# EasyEDA Pro project miniMQ.epro, schematic Controller
Board Name: Controller; Create Date: 2026-08-29; Page Name: P1; Project Name: MagicQ Compact Mini Connect; Schematic Name: Controller; Update Date: 2026-09-06; Company: EasyEDA.com; Page Size: A4; Version: V1.0
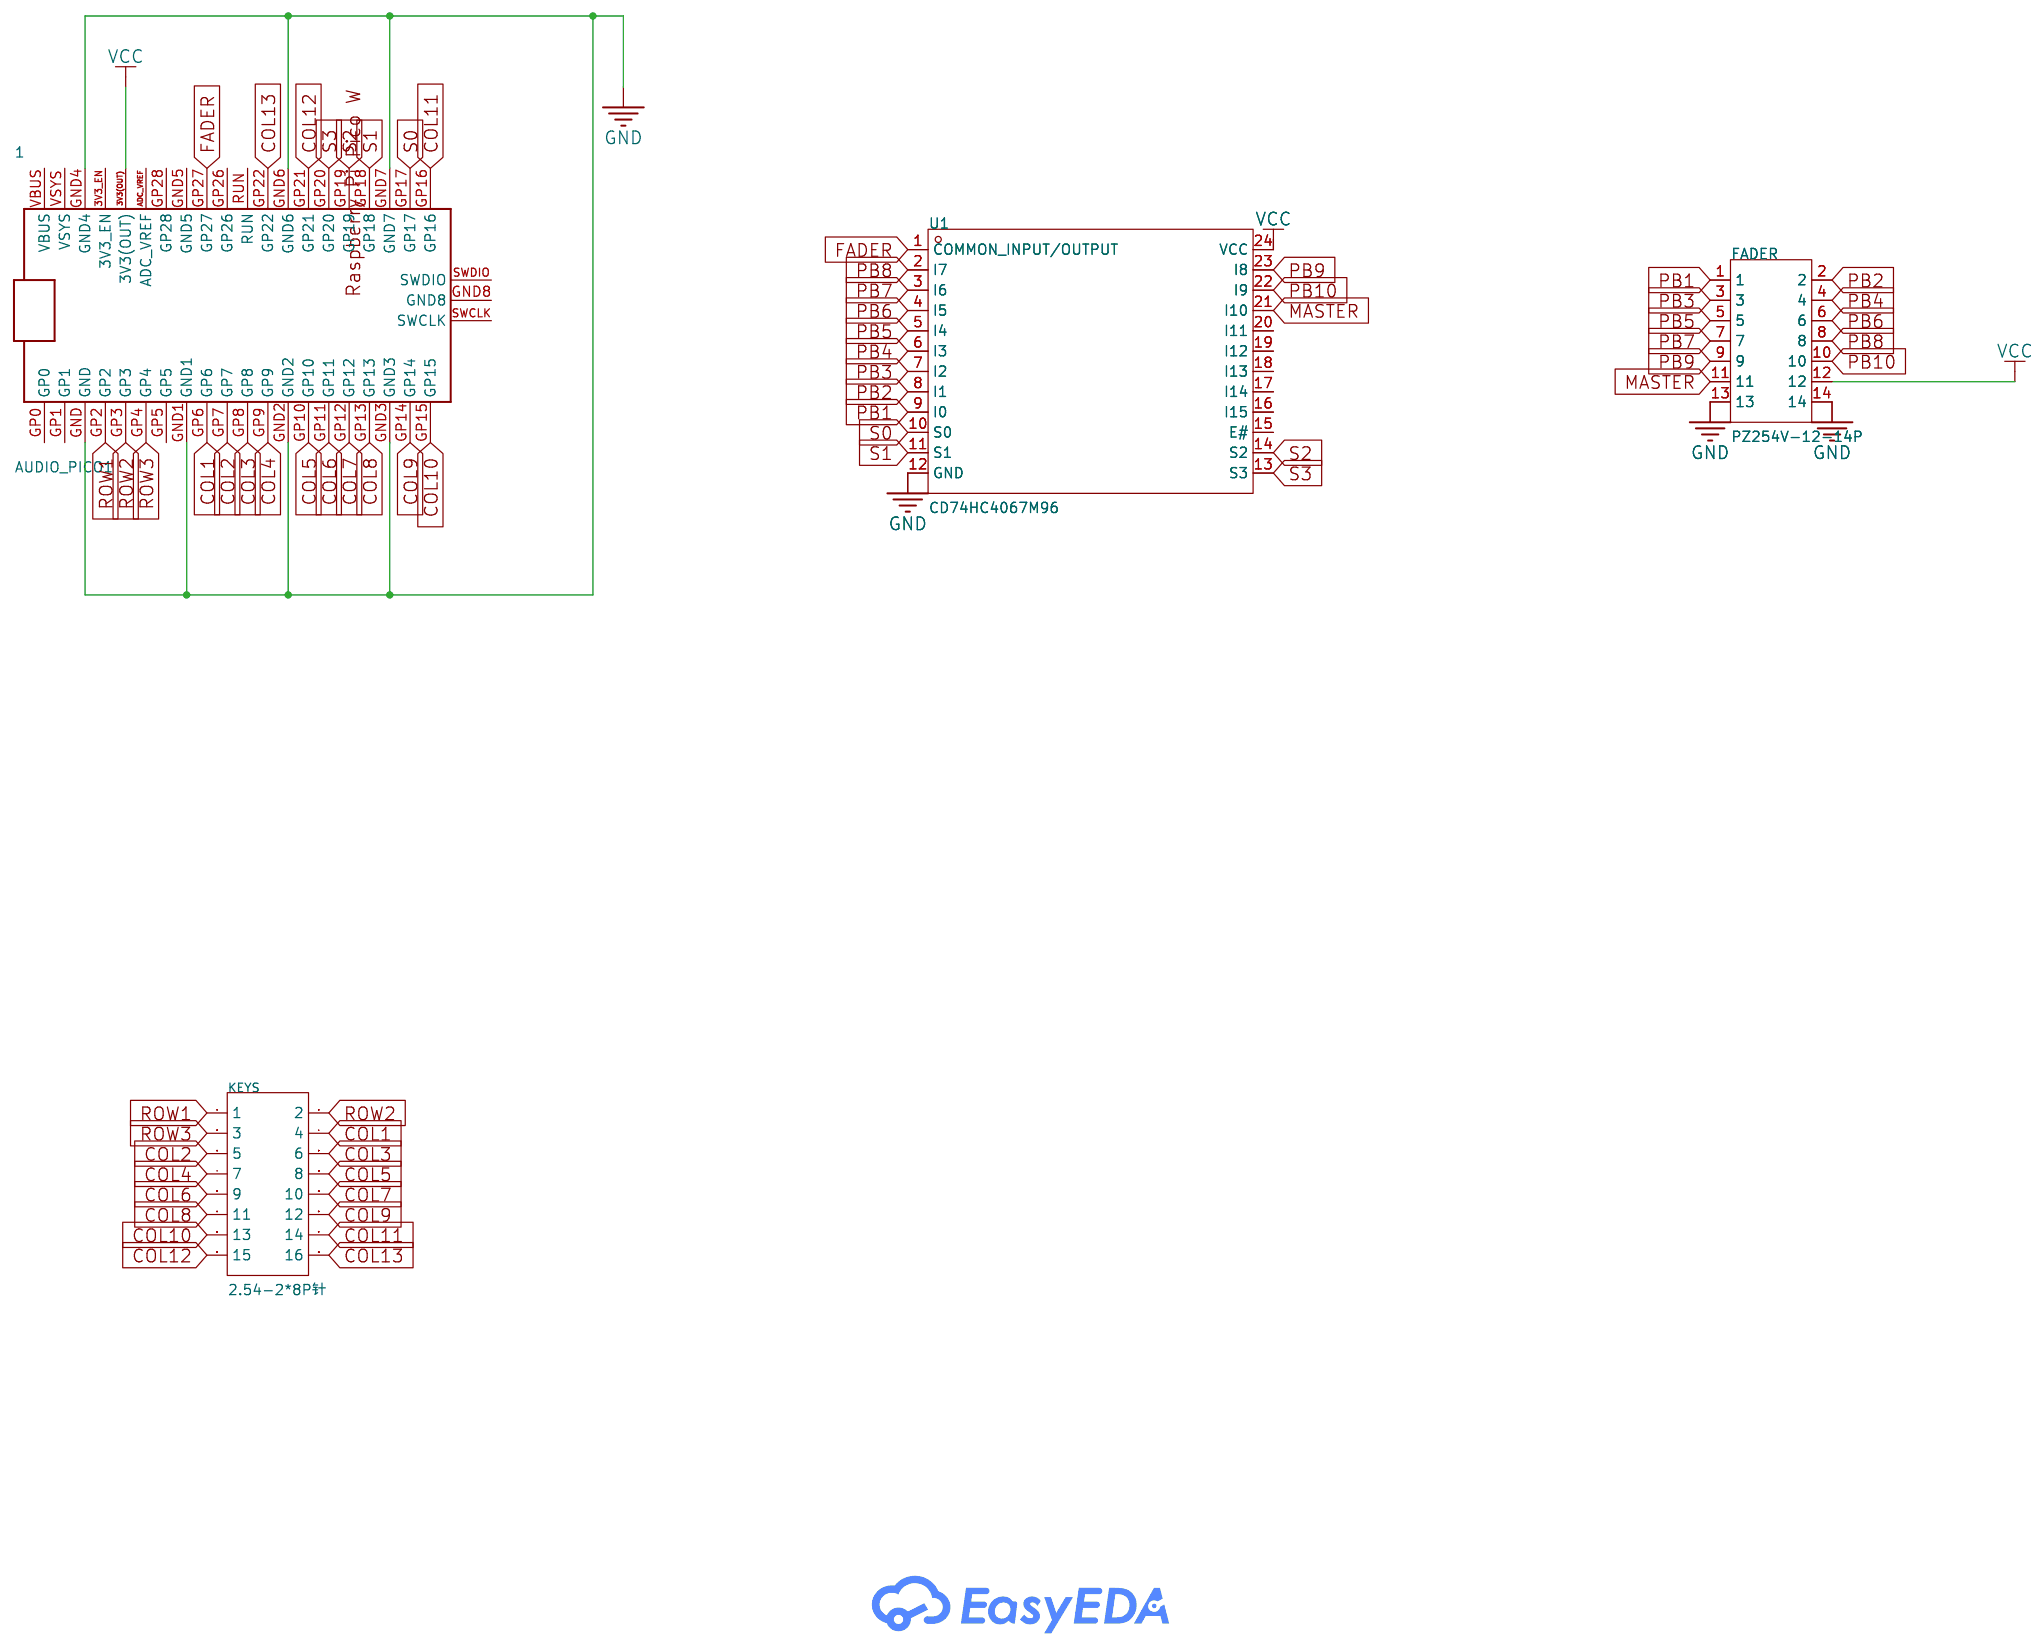
[diagram p0: schematic sheet]

## Parts
1  AUDIO_PICO1  [RASPBERRYPIPICO]
FADER  PZ254V-12-14P  [HDR-TH_14P-P2.54-V-M-R2-C7-S2.54]
KEYS  2.54-2*8P针  [HDR-TH_16P-P2.54-V-M-R2-C8-S2.54]
U1  CD74HC4067M96  [SOIC-24_L15.4-W7.5-P1.27-LS10.3-BL]

## Library data of the parts
1 = AUDIO_PICO1: Manufacturer Part: RASPBERRY PI PICO; Supplier: Element14; Supplier Part: 3643332; Manufacturer: Raspberry-PI; link: https://se.farnell.com/b/raspberry-pi
FADER = PZ254V-12-14P: Pin Structure:2x7P Pitch:2.54mm Row Spacing:2.54mm Circluar Pins/Square Pins:Pin Header Mounting Type:Through Hole Number of Rows:2 Number of Pins:14P Current Rating:- Voltage Rating (Max):- Length of Mating Pin:6mm Insulation Height:2.5mm Length of End C; LCSC Part Name: 2x7P 间距:2.54mm 方针 直插; Supplier Part: C492424; Manufacturer: XFCN(兴飞); Supplier Footprint: 插件,P=2.54mm; JLCPCB Part Class: Extended Part; Datasheet: https://item.szlcsc.com/datasheet/PZ254V-12-14P/502980.html; Supplier: LCSC; Pin Structure: 2x7P; Pitch: 2.54mm; Row Spacing: 2.54mm; Circluar Pins/Square Pins: Pin Header; Mounting Type: Through Hole; Number of Rows: 2; Number of Pins: 14P; Length of Mating Pin: 6mm; Insulation Height: 2.5mm; Length of End Connection Pin: 3mm; Contact Material: Brass; Operating Temperature: -40℃~+105℃; Color: Black
KEYS = 2.54-2*8P针_C68234: Pin Structure:2x8P Pitch:2.54mm Row Spacing:2.54mm Circluar Pins/Square Pins:Pin Header Mounting Type:Through Hole Number of Rows:2 Number of Pins:16P Current Rating:3A Voltage Rating (Max):- Length of Mating Pin:5.9mm Insulation Height:2.54mm Length of E; LCSC Part Name: 2x8P 间距:2.54mm 方针 直插; Supplier Part: C68234; Manufacturer: BOOMELE(博穆精密); Supplier Footprint: 插件,P=2.54mm; JLCPCB Part Class: Extended Part; Datasheet: https://item.szlcsc.com/datasheet/2.54-2*8P%25E9%2592%2588/69336.html; Supplier: LCSC; Pin Structure: 2x8P; Pitch: 2.54mm; Row Spacing: 2.54mm; Circluar Pins/Square Pins: Pin Header; Mounting Type: Through Hole; Number of Rows: 2; Number of Pins: 16P; Current Rating: 3A; Length of Mating Pin: 5.9mm; Insulation Height: 2.54mm; Length of End Connection Pin: 3mm; Contact Material: Brass; Contact Plating: Gold; Operating Temperature: -55℃~+105℃; Color: Black
U1 = CD74HC4067M96: Switch Circuit:16:1 Number of Channels:16 Ron:70Ω Voltage - Supply:2V~6V Voltage - Supply:2V~6V Con:- Turn-on time:83ns Turn-off time:83ns Bandwidth:89MHz Operating Temperature:-55℃~+125℃ Operating Temperature:-55℃~+125℃ Propagation Delay (tpd):15ns Featu; LCSC Part Name: 高速CMOS逻辑16通道模拟多路复用器/解复用器; Supplier Part: C496123; Manufacturer: TI(德州仪器); Supplier Footprint: SOIC-24-300mil; JLCPCB Part Class: Extended Part; Datasheet: https://www.ti.com/cn/lit/gpn/cd74hc4067; Supplier: LCSC; Switch Circuit: 16:1; Number of Channels: 16; Ron: 70Ω; Voltage - Supply: 2V~6V; Turn-on time: 83ns; Turn-off time: 83ns; Bandwidth: 89MHz; Operating Temperature: -55℃~+125℃; Propagation Delay (tpd): 15ns; Features: Bidirectional analog channel

## Nets
GND: 1.GND 1.GND1 1.GND2 1.GND3 1.GND4 1.GND6 1.GND7 FADER.13 FADER.14 U1.12(GND)
VCC: 1.3V3(OUT) FADER.12 U1.24(VCC)
COL1: 1.GP6 KEYS.4
COL2: 1.GP7 KEYS.5
COL3: 1.GP8 KEYS.6
COL4: 1.GP9 KEYS.7
COL5: 1.GP10 KEYS.8
COL6: 1.GP11 KEYS.9
COL7: 1.GP12 KEYS.10
COL8: 1.GP13 KEYS.11
COL9: 1.GP14 KEYS.12
COL10: 1.GP15 KEYS.13
COL11: 1.GP16 KEYS.14
COL12: 1.GP21 KEYS.15
COL13: 1.GP22 KEYS.16
FADER: 1.GP27 U1.1(COMMON INPUT/OUTPUT)
MASTER: FADER.11 U1.21(I10)
PB1: FADER.1 U1.9(I0)
PB2: FADER.2 U1.8(I1)
PB3: FADER.3 U1.7(I2)
PB4: FADER.4 U1.6(I3)
PB5: FADER.5 U1.5(I4)
PB6: FADER.6 U1.4(I5)
PB7: FADER.7 U1.3(I6)
PB8: FADER.8 U1.2(I7)
PB9: FADER.9 U1.23(I8)
PB10: FADER.10 U1.22(I9)
ROW1: 1.GP2 KEYS.1
ROW2: 1.GP3 KEYS.2
ROW3: 1.GP4 KEYS.3
S0: 1.GP17 U1.10(S0)
S1: 1.GP18 U1.11(S1)
S2: 1.GP19 U1.14(S2)
S3: 1.GP20 U1.13(S3)

Not connected (* = marked no-connect by the designer): 1 3V3_EN ADC_VREF GND5 GND8 GP0 GP1 GP5 GP26 GP28 RUN SWCLK SWDIO VBUS VSYS; U1 15(E#) 16(I15) 17(I14) 18(I13) 19(I12) 20(I11)
